# Altium schematic sheet esp32.SchDoc
size A3
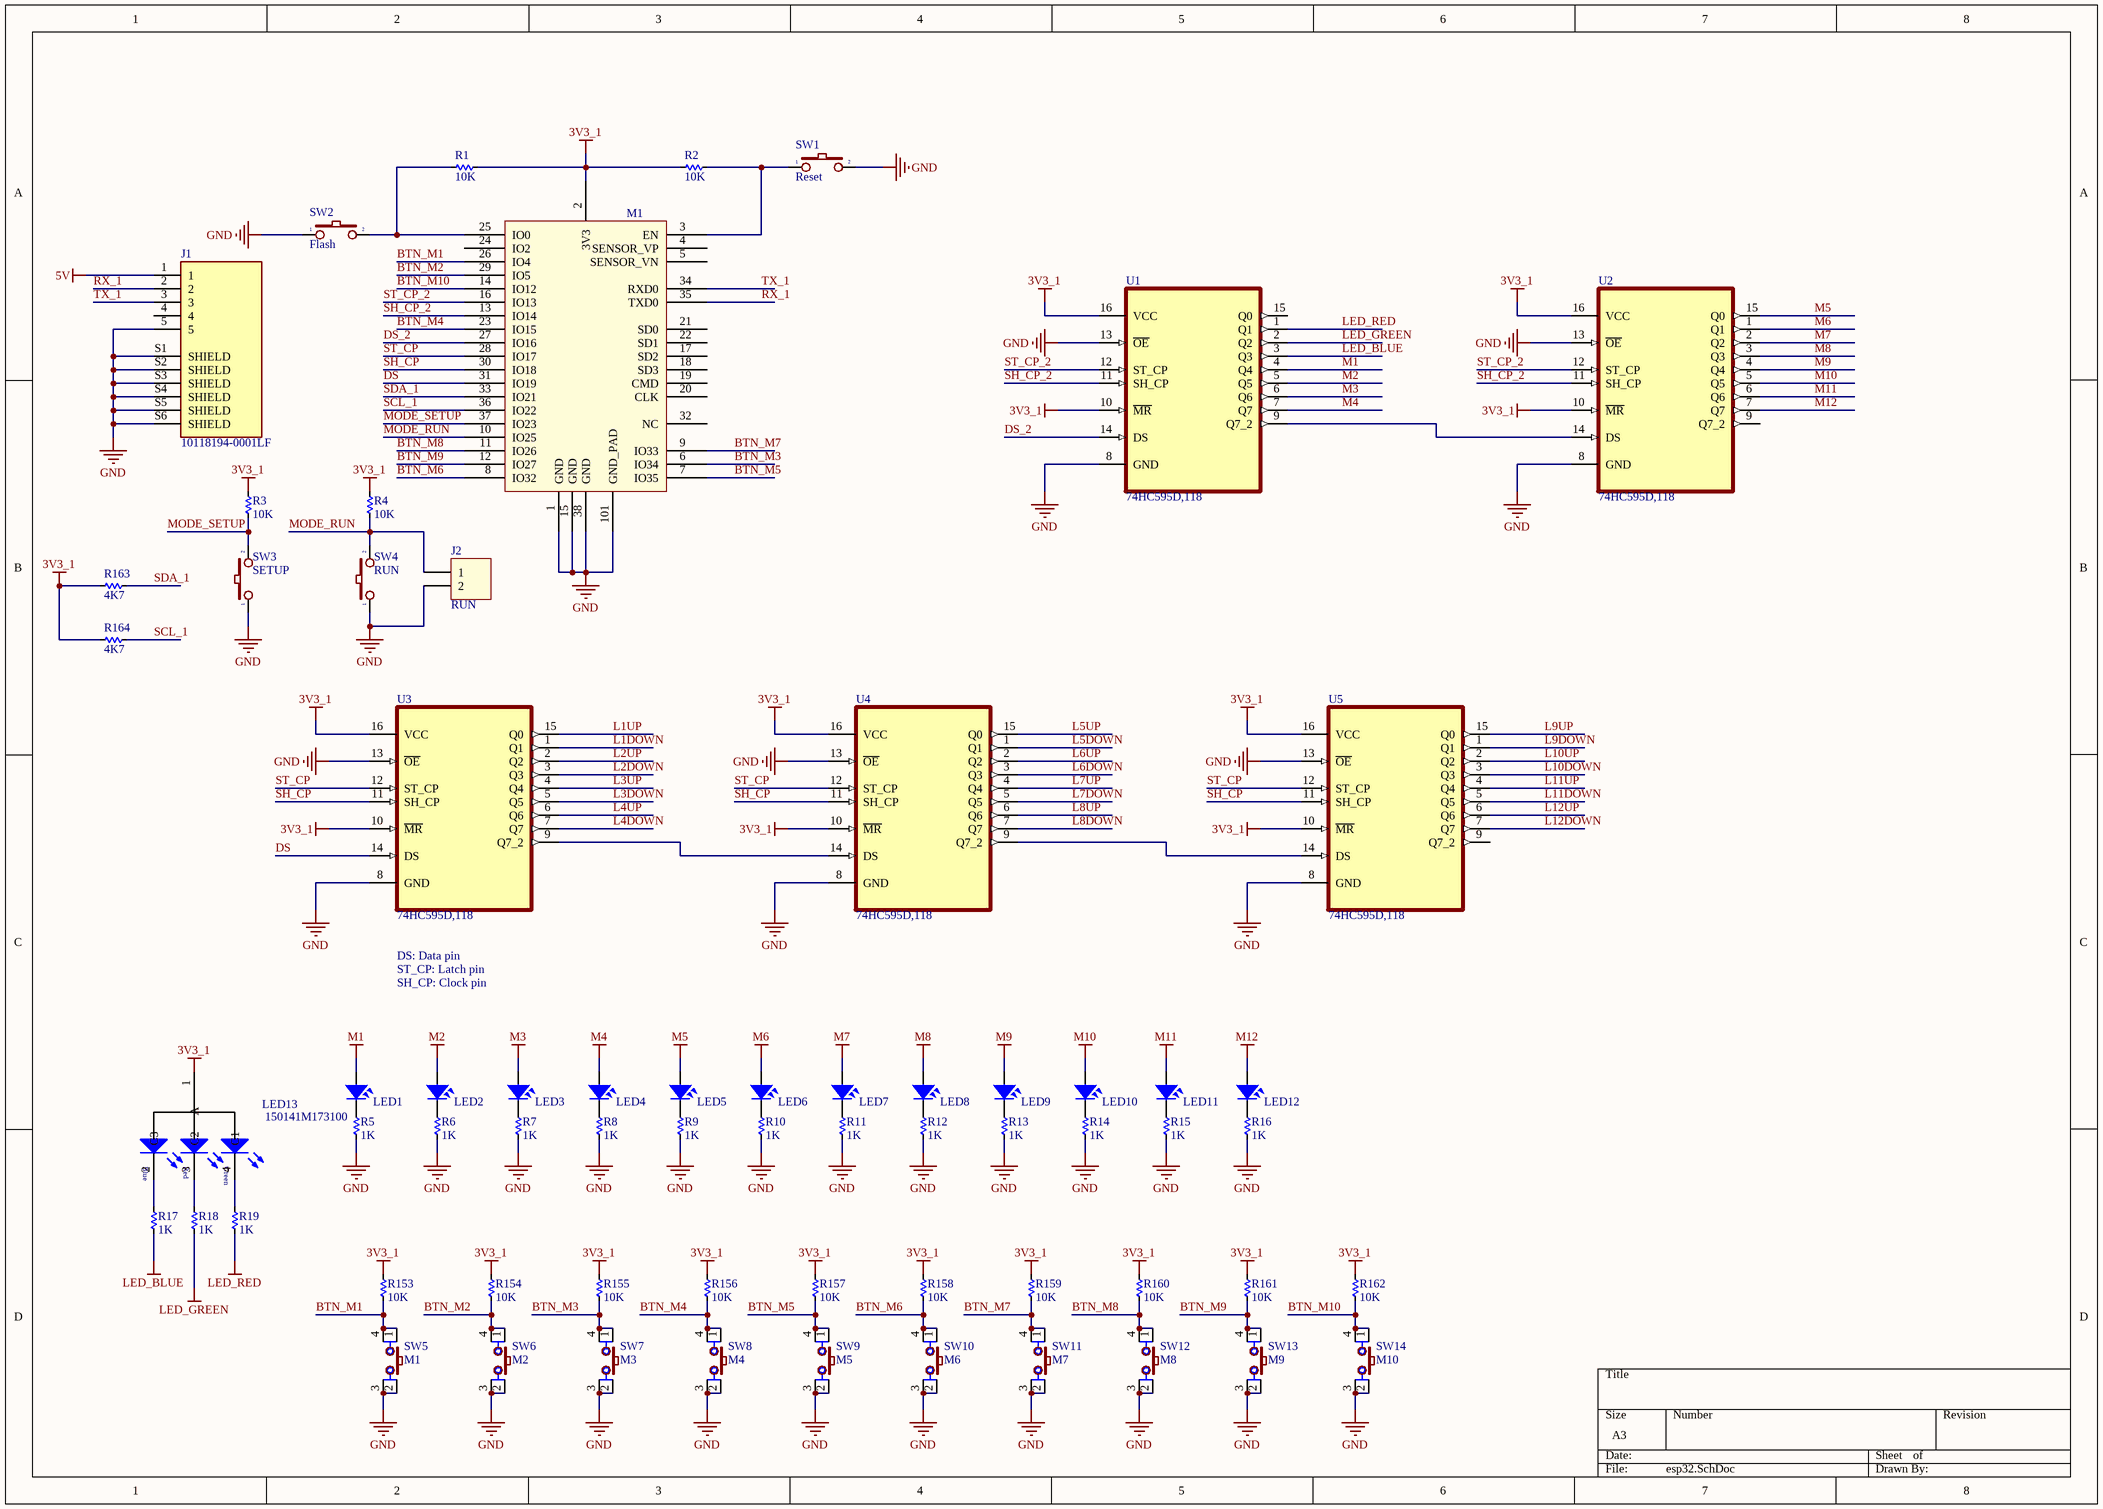
[diagram p0: esp32.SchDoc]

## Parts
J1  10118194-0001LF  [AMPHENOL_10118194-0001LF]
J2  RUN  [62000211622]
LED1  LED  [LED-0805-Blue]  (value not drawn)
LED2  LED  [LED-0805-Blue]  (value not drawn)
LED3  LED  [LED-0805-Blue]  (value not drawn)
LED4  LED  [LED-0805-Blue]  (value not drawn)
LED5  LED  [LED-0805-Blue]  (value not drawn)
LED6  LED  [LED-0805-Blue]  (value not drawn)
LED7  LED  [LED-0805-Blue]  (value not drawn)
LED8  LED  [LED-0805-Blue]  (value not drawn)
LED9  LED  [LED-0805-Blue]  (value not drawn)
LED10  LED  [LED-0805-Blue]  (value not drawn)
LED11  LED  [LED-0805-Blue]  (value not drawn)
LED12  LED  [LED-0805-Blue]  (value not drawn)
LED13  150141M173100  [LED RGB 3528]
M1  ESP32S_Module  [ESP32S]  (value not drawn)
R1  10K  [RES-SMD-0805]
R2  10K  [RES-SMD-0805]
R3  10K  [RES-SMD-0805]
R4  10K  [RES-SMD-0805]
R5  1K  [RES-SMD-0805]
R6  1K  [RES-SMD-0805]
R7  1K  [RES-SMD-0805]
R8  1K  [RES-SMD-0805]
R9  1K  [RES-SMD-0805]
R10  1K  [RES-SMD-0805]
R11  1K  [RES-SMD-0805]
R12  1K  [RES-SMD-0805]
R13  1K  [RES-SMD-0805]
R14  1K  [RES-SMD-0805]
R15  1K  [RES-SMD-0805]
R16  1K  [RES-SMD-0805]
R17  1K  [RES-SMD-0805]
R18  1K  [RES-SMD-0805]
R19  1K  [RES-SMD-0805]
R153  10K  [RES-SMD-0805]
R154  10K  [RES-SMD-0805]
R155  10K  [RES-SMD-0805]
R156  10K  [RES-SMD-0805]
R157  10K  [RES-SMD-0805]
R158  10K  [RES-SMD-0805]
R159  10K  [RES-SMD-0805]
R160  10K  [RES-SMD-0805]
R161  10K  [RES-SMD-0805]
R162  10K  [RES-SMD-0805]
R163  4K7  [RES-SMD-0805]
R164  4K7  [RES-SMD-0805]
SW1  Reset  [SW1-SMD]
SW2  Flash  [SW-DIP1-1]
SW3  SETUP  [SW-DIP1-1]
SW4  RUN  [SW-DIP1-1]
SW5  M1  [SW2-SMD]
SW6  M2  [SW2-SMD]
SW7  M3  [SW2-SMD]
SW8  M4  [SW2-SMD]
SW9  M5  [SW2-SMD]
SW10  M6  [SW2-SMD]
SW11  M7  [SW2-SMD]
SW12  M8  [SW2-SMD]
SW13  M9  [SW2-SMD]
SW14  M10  [SW2-SMD]
U1  74HC595D,118  [SOIC127P600X175-16N]
U2  74HC595D,118  [SOIC127P600X175-16N]
U3  74HC595D,118  [SOIC127P600X175-16N]
U4  74HC595D,118  [SOIC127P600X175-16N]
U5  74HC595D,118  [SOIC127P600X175-16N]

## Nets
3V3_1: LED13.1(A) M1.2(3V3) R1.1 R2.2 R3.1 R4.1 R153.1 R154.1 R155.1 R156.1 R157.1 R158.1 R159.1 R160.1 R161.1 R162.1 R163.1 R164.1 U1.10(~{MR}) U1.16(VCC) U2.10(~{MR}) U2.16(VCC) U3.10(~{MR}) U3.16(VCC) U4.10(~{MR}) U4.16(VCC) U5.10(~{MR}) U5.16(VCC)
5V: J1.1
GND: J1.5 J1.S1(SHIELD) J1.S2(SHIELD) J1.S3(SHIELD) J1.S4(SHIELD) J1.S5(SHIELD) J1.S6(SHIELD) J2.2 M1.1(GND) M1.15(GND) M1.38(GND) M1.101(GND_PAD) R5.2 R6.2 R7.2 R8.2 R9.2 R10.2 R11.2 R12.2 R13.2 R14.2 R15.2 R16.2 SW1.2 SW2.1 SW3.1 SW4.1 SW5.2 SW5.3 SW6.2 SW6.3 SW7.2 SW7.3 SW8.2 SW8.3 SW9.2 SW9.3 SW10.2 SW10.3 SW11.2 SW11.3 SW12.2 SW12.3 SW13.2 SW13.3 SW14.2 SW14.3 U1.8(GND) U1.13(~{OE}) U2.8(GND) U2.13(~{OE}) U3.8(GND) U3.13(~{OE}) U4.8(GND) U4.13(~{OE}) U5.8(GND) U5.13(~{OE})
LED_BLUE: R17.2 U1.3(Q3)
LED_GREEN: R18.2 U1.2(Q2)
LED_RED: R19.2 U1.1(Q1)
M1: LED1.1 U1.4(Q4)
M2: LED2.1 U1.5(Q5)
M3: LED3.1 U1.6(Q6)
M4: LED4.1 U1.7(Q7)
M5: LED5.1 U2.15(Q0)
M6: LED6.1 U2.1(Q1)
M7: LED7.1 U2.2(Q2)
M8: LED8.1 U2.3(Q3)
M9: LED9.1 U2.4(Q4)
M10: LED10.1 U2.5(Q5)
M11: LED11.1 U2.6(Q6)
M12: LED12.1 U2.7(Q7)
BTN_M1: M1.26(IO4) R153.2 SW5.1 SW5.4
BTN_M2: M1.29(IO5) R154.2 SW6.1 SW6.4
BTN_M3: M1.6(IO34) R155.2 SW7.1 SW7.4
BTN_M4: M1.23(IO15) R156.2 SW8.1 SW8.4
BTN_M5: M1.7(IO35) R157.2 SW9.1 SW9.4
BTN_M6: M1.8(IO32) R158.2 SW10.1 SW10.4
BTN_M7: M1.9(IO33) R159.2 SW11.1 SW11.4
BTN_M8: M1.11(IO26) R160.2 SW12.1 SW12.4
BTN_M9: M1.12(IO27) R161.2 SW13.1 SW13.4
BTN_M10: M1.14(IO12) R162.2 SW14.1 SW14.4
DS: M1.31(IO19) U3.14(DS)
DS_2: M1.27(IO16) U1.14(DS)
L1DOWN: U3.1(Q1)
L1UP: U3.15(Q0)
L2DOWN: U3.3(Q3)
L2UP: U3.2(Q2)
L3DOWN: U3.5(Q5)
L3UP: U3.4(Q4)
L4DOWN: U3.7(Q7)
L4UP: U3.6(Q6)
L5DOWN: U4.1(Q1)
L5UP: U4.15(Q0)
L6DOWN: U4.3(Q3)
L6UP: U4.2(Q2)
L7DOWN: U4.5(Q5)
L7UP: U4.4(Q4)
L8DOWN: U4.7(Q7)
L8UP: U4.6(Q6)
L9DOWN: U5.1(Q1)
L9UP: U5.15(Q0)
L10DOWN: U5.3(Q3)
L10UP: U5.2(Q2)
L11DOWN: U5.5(Q5)
L11UP: U5.4(Q4)
L12DOWN: U5.7(Q7)
L12UP: U5.6(Q6)
MODE_RUN: J2.1 M1.10(IO25) R4.2 SW4.2
MODE_SETUP: M1.37(IO23) R3.2 SW3.2
RX_1: J1.2 M1.35(TXD0)
SCL_1: M1.36(IO22) R164.2
SDA_1: M1.33(IO21) R163.2
SH_CP: M1.30(IO18) U3.11(SH_CP) U4.11(SH_CP) U5.11(SH_CP)
SH_CP_2: M1.13(IO14) U1.11(SH_CP) U2.11(SH_CP)
ST_CP: M1.28(IO17) U3.12(ST_CP) U4.12(ST_CP) U5.12(ST_CP)
ST_CP_2: M1.16(IO13) U1.12(ST_CP) U2.12(ST_CP)
TX_1: J1.3 M1.34(RXD0)
NetLED1_2: LED1.2 R5.1
NetLED2_2: LED2.2 R6.1
NetLED3_2: LED3.2 R7.1
NetLED4_2: LED4.2 R8.1
NetLED5_2: LED5.2 R9.1
NetLED6_2: LED6.2 R10.1
NetLED7_2: LED7.2 R11.1
NetLED8_2: LED8.2 R12.1
NetLED9_2: LED9.2 R13.1
NetLED10_2: LED10.2 R14.1
NetLED11_2: LED11.2 R15.1
NetLED12_2: LED12.2 R16.1
NetLED13_2: LED13.2(C3) R17.1
NetLED13_3: LED13.3(C2) R18.1
NetLED13_4: LED13.4(C1) R19.1
NetM1_3: M1.3(EN) R2.1 SW1.1
NetM1_25: M1.25(IO0) R1.2 SW2.2
NetU1_9: U1.9(Q7_2) U2.14(DS)
NetU3_9: U3.9(Q7_2) U4.14(DS)
NetU4_9: U4.9(Q7_2) U5.14(DS)

Not connected (* = marked no-connect by the designer): J1 4; M1 4(SENSOR_VP) 5(SENSOR_VN) 17(SD2) 18(SD3) 19(CMD) 20(CLK) 21(SD0) 22(SD1) 24(IO2) 32(NC); U1 15(Q0); U2 9(Q7_2); U5 9(Q7_2)

## Notes on the sheet
- DS: Data pin
- ST_CP: Latch pin
- SH_CP: Clock pin
- (in symbol LED RGB SMD) Blue; Red; Green

## Library data of the parts
J1 = 10118194-0001LF: USB - micro B USB 2.0 Receptacle Connector 5 Position Surface Mount, Right Angle; Through Hole; MF: Amphenol ICC; Package: None; Price: None; Availability: Unavailable; MP: 10118194-0001LF; SnapEDA_Link: https://www.snapeda.com/parts/10118194-0001LF/Amphenol%20FCI/view-part/1413308/?ref=snap; Value: *
J2 = 62000211622: WR-WTB 2.00mm Male Vertical Shrouded Header, 2p; Pin Number: 2; ComponentLink1Description: Manufacturer; ComponentLink1URL: http://www.we-online.de; ComponentLink2Description: Datasheet; ComponentLink2URL: http://katalog.we-online.de/em/datasheet/6200xx11622.pdf; Part Number: 62000211622; Published Date: June 2017; Publisher: Wurth Elektronik; Pitch: 2.00 mm
LED1-LED12 = LED SMD: Value: LED 3 - 5 ly 2 Colour
LED13 = LED RGB SMD: SMD Full-Color Top LED, WL-SFTW, Red & Green & Blue; Manufacturer: Würth Elektronik eiSos GmbH; PartNo: 150141M173100; ComponentLink1Description: Manufacturer; ComponentLink1URL: http://www.we-online.de; Created by: Christin Otto; Created Date: June 2013; ComponentLink2Description: Datasheet; ComponentLink2URL: http://katalog.we-online.com/led/datasheet/150141M173100.pdf; Color: Red & Green & Blue
M1 = ESP32S_Module: Esp-32S; Datasheet: https://espressif.com/sites/default/files/documentation/esp_wroom_32_datasheet_en.pdf
R1-R19 R153-R164 = Res-SMD: Resistor; Manufacturer: Generic Components; Class: Passive; Published: 08/06/2000; Publisher: Altium Hobart Technology Centre
SW1-SW4 = SW2: Switch button 2 pin; Value: SW chip 2 pin
SW5-SW14 = SW4: Switch button 4 pin; Value: Button chip 4 pin
U1-U5 = 74HC595D,118: Shift Shift Register 1 Element 8 Bit 16-SO; MF: Nexperia USA Inc.; Package: None; Check_prices: https://www.snapeda.com/parts/74HC595D,118/Nexperia/view-part/5160062/?ref=eda; Purchase-URL: https://pricing.snapeda.com/search/part/74HC595D,118/?ref=eda; Value: *; MP: 74HC595D,118; Availability: Good; SnapEDA_Link: https://www.snapeda.com/parts/74HC595D,118/Nexperia/view-part/5160062/?ref=snap; Price: None